# Altium schematic sheet HDMI.SchDoc
size A4
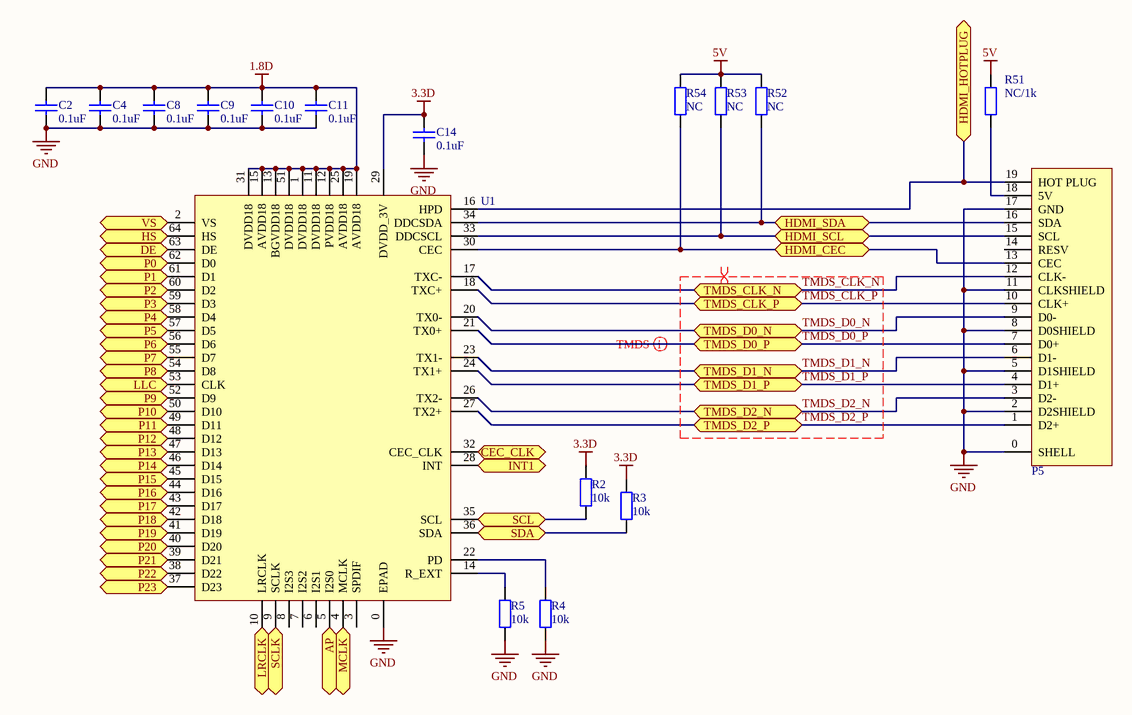
[diagram p0: HDMI.SchDoc]

## Parts
C2  value 0.1uF  [0402]  (hidden comment: Cap)
C4  value 0.1uF  [0402]  (hidden comment: Cap)
C8  value 0.1uF  [0402]  (hidden comment: Cap)
C9  value 0.1uF  [0402]  (hidden comment: Cap)
C10  value 0.1uF  [0402]  (hidden comment: Cap)
C11  value 0.1uF  [0402]  (hidden comment: Cap)
C14  value 0.1uF  [0402]  (hidden comment: Cap)
P5  HDMI  [HDMI-A]  (value not drawn)
R2  10k  [0402]
R3  10k  [0402]
R4  10k  [0402]
R5  10k  [0402]
R51  NC/1k  [0402]
R52  NC  [0402]
R53  NC  [0402]
R54  NC  [0402]
U1  ADV7513  [ADV7611]  (value not drawn)

## Ports
AP, CEC_CLK, DE, HDMI_CEC, HDMI_HOTPLUG, HDMI_SCL, HDMI_SDA, HS, INT1, LLC, LRCLK, MCLK, P0, P1, P2, P3, P4, P5, P6, P7, P8, P9, P10, P11, P12, P13, P14, P15, P16, P17, P18, P19, P20, P21, P22, P23, SCL, SCLK, SDA, TMDS_CLK_N, TMDS_CLK_P, TMDS_D0_N, TMDS_D0_P, TMDS_D1_N, TMDS_D1_P, TMDS_D2_N, TMDS_D2_P, VS

## Nets
1.8D: C2.2 C4.2 C8.2 C9.2 C10.2 C11.2 U1.1(DVDD18) U1.11(DVDD18) U1.12(PVDD18) U1.13(BGVDD18) U1.15(AVDD18) U1.19(AVDD18) U1.25(AVDD18) U1.31(DVDD18) U1.51(DVDD18)
3.3D: C14.2 R2.1 R3.1 U1.29(DVDD_3V)
5V: R51.2 R52.1 R53.1 R54.1
GND: C2.1 C4.1 C8.1 C9.1 C10.1 C11.1 C14.1 P5.0(SHELL) P5.2(D2SHIELD) P5.5(D1SHIELD) P5.8(D0SHIELD) P5.11(CLKSHIELD) P5.17(GND) R4.2 R5.2 U1.0(EPAD)
AP: U1.5(I2S0) ; port AP
CEC_CLK: U1.32(CEC_CLK) ; port CEC_CLK
DE: U1.63(DE) ; port DE
HDMI_CEC: P5.13(CEC) R54.2 U1.30(CEC) ; port HDMI_CEC
HDMI_HOTPLUG: P5.19(HOT_PLUG) U1.16(HPD) ; port HDMI_HOTPLUG
HDMI_SCL: P5.15(SCL) R53.2 U1.33(DDCSCL) ; port HDMI_SCL
HDMI_SDA: P5.16(SDA) R52.2 U1.34(DDCSDA) ; port HDMI_SDA
HS: U1.64(HS) ; port HS
INT1: U1.28(INT) ; port INT1
LLC: U1.53(CLK) ; port LLC
LRCLK: U1.10(LRCLK) ; port LRCLK
MCLK: U1.4(MCLK) ; port MCLK
P0: U1.62(D0) ; port P0
P1: U1.61(D1) ; port P1
P2: U1.60(D2) ; port P2
P3: U1.59(D3) ; port P3
P4: U1.58(D4) ; port P4
P5: U1.57(D5) ; port P5
P6: U1.56(D6) ; port P6
P7: U1.55(D7) ; port P7
P8: U1.54(D8) ; port P8
P9: U1.52(D9) ; port P9
P10: U1.50(D10) ; port P10
P11: U1.49(D11) ; port P11
P12: U1.48(D12) ; port P12
P13: U1.47(D13) ; port P13
P14: U1.46(D14) ; port P14
P15: U1.45(D15) ; port P15
P16: U1.44(D16) ; port P16
P17: U1.43(D17) ; port P17
P18: U1.42(D18) ; port P18
P19: U1.41(D19) ; port P19
P20: U1.40(D20) ; port P20
P21: U1.39(D21) ; port P21
P22: U1.38(D22) ; port P22
P23: U1.37(D23) ; port P23
SCL: R2.2 U1.35(SCL) ; port SCL
SCLK: U1.9(SCLK) ; port SCLK
SDA: R3.2 U1.36(SDA) ; port SDA
TMDS_CLK_N: P5.12(CLK-) U1.17(TXC-) ; port TMDS_CLK_N
TMDS_CLK_P: P5.10(CLK+) U1.18(TXC+) ; port TMDS_CLK_P
TMDS_D0_N: P5.9(D0-) U1.20(TX0-) ; port TMDS_D0_N
TMDS_D0_P: P5.7(D0+) U1.21(TX0+) ; port TMDS_D0_P
TMDS_D1_N: P5.6(D1-) U1.23(TX1-) ; port TMDS_D1_N
TMDS_D1_P: P5.4(D1+) U1.24(TX1+) ; port TMDS_D1_P
TMDS_D2_N: P5.3(D2-) U1.26(TX2-) ; port TMDS_D2_N
TMDS_D2_P: P5.1(D2+) U1.27(TX2+) ; port TMDS_D2_P
VS: U1.2(VS) ; port VS
NetP5_18: P5.18(5V) R51.1
NetR4_1: R4.1 U1.22(PD)
NetR5_1: R5.1 U1.14(R_EXT)

Not connected (* = marked no-connect by the designer): P5 14(RESV); U1 3(SPDIF) 6(I2S1) 7(I2S2) 8(I2S3)

## Layout directives
differential pair: TMDS_CLK_N, TMDS_CLK_P, TMDS_D0_N, TMDS_D0_P, TMDS_D1_N, TMDS_D1_P, TMDS_D2_N, TMDS_D2_P
net class TMDS: TMDS_D0_P

## Library data of the parts
C2 C4 C8-C11 C14 = Cap: Capacitor; Published: 8-Jun-2000; LatestRevisionDate: 17-Jul-2002; LatestRevisionNote: Re-released for DXP Platform.; PackageReference: RAD-0.3; Publisher: Altium Limited; PackageDescription: Radial Cap, Thru-Hole; 2 Leads; 0.3 in Pin Spacing
R2-R5 R51-R54 = Res2: Resistor; Value: 0Ohm; Published: 8-Jun-2000; LatestRevisionDate: 17-Jul-2002; LatestRevisionNote: Re-released for DXP Platform.; PackageReference: AXIAL-0.4; Publisher: Altium Limited; PackageDescription: Axial Device, Thru-Hole; 2 Leads; 0.4 in Pin Spacing